# EAGLE schematic M226A (EAGLE 6.6.0)
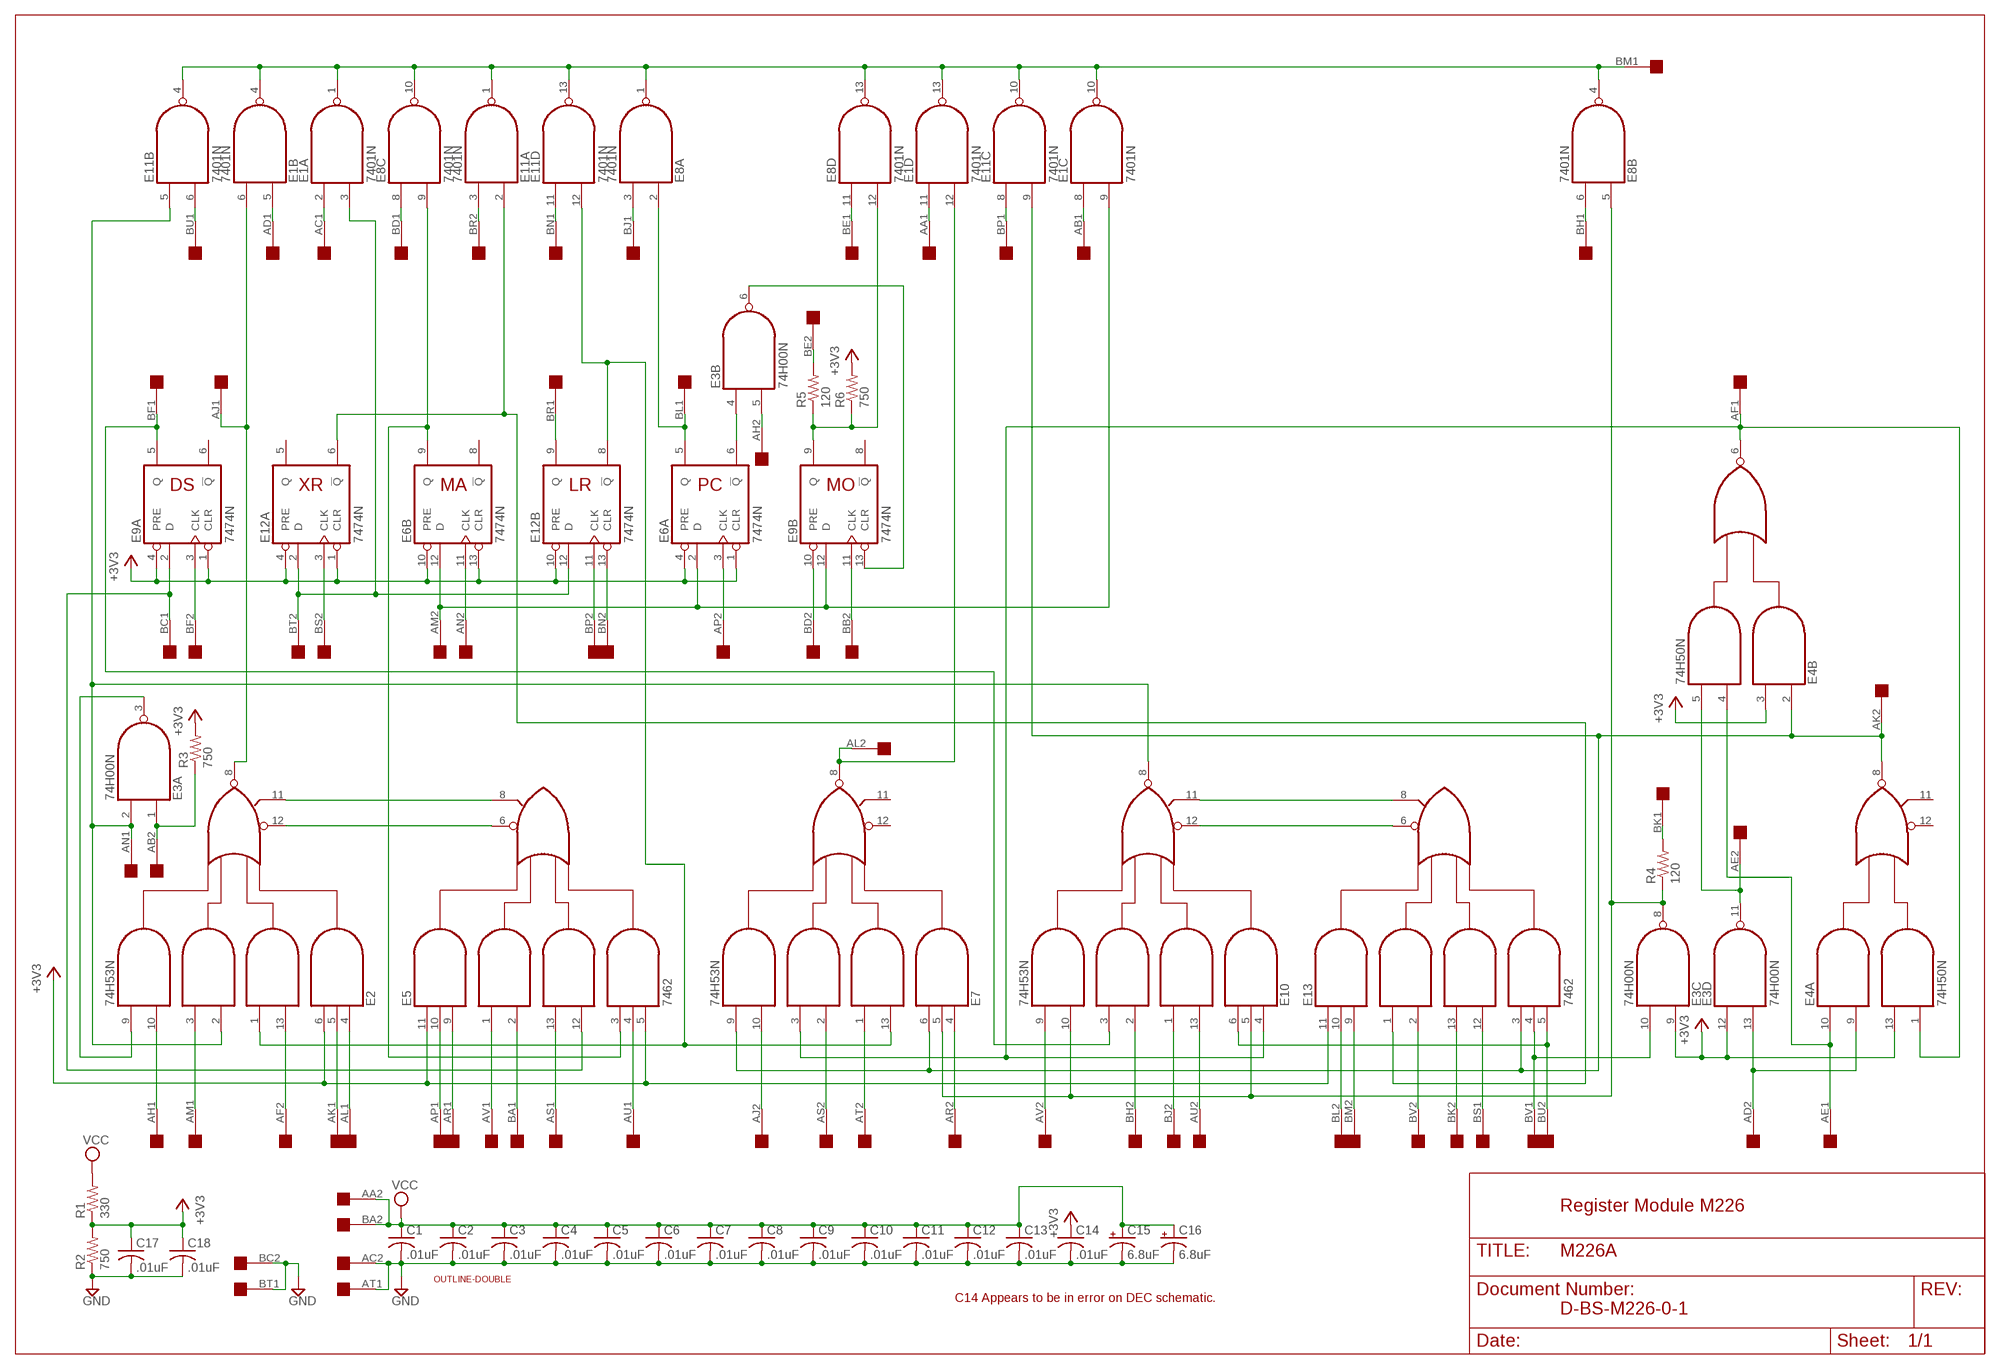
[diagram p0: schematic, sheet 1]

## Parts
C1  .01uF  C-US050-025X075  [C050-025X075]
C2  .01uF  C-US050-025X075  [C050-025X075]
C3  .01uF  C-US050-025X075  [C050-025X075]
C4  .01uF  C-US050-025X075  [C050-025X075]
C5  .01uF  C-US050-025X075  [C050-025X075]
C6  .01uF  C-US050-025X075  [C050-025X075]
C7  .01uF  C-US050-025X075  [C050-025X075]
C8  .01uF  C-US050-025X075  [C050-025X075]
C9  .01uF  C-US050-025X075  [C050-025X075]
C10  .01uF  C-US050-025X075  [C050-025X075]
C11  .01uF  C-US050-025X075  [C050-025X075]
C12  .01uF  C-US050-025X075  [C050-025X075]
C13  .01uF  C-US050-025X075  [C050-025X075]
C14  .01uF  C-US050-025X075  [C050-025X075]
C15  6.8uF  CPOL-USE20-8AXIAL  [E12-8]
C16  6.8uF  CPOL-USE20-8AXIAL  [E12-8]
C17  .01uF  C-US050-025X075  [C050-025X075]
C18  .01uF  C-US050-025X075  [C050-025X075]
E1  7401N  74LS01N  [DIL14]
E2  74H53N  [DIL14]
E3  74H00N  74S00N  [DIL14]
E4  74H50N  7450N  [DIL14]
E5  7462  [DIL14]
E6  7474N  74S74N  [DIL14]
E7  74H53N  [DIL14]
E8  7401N  74LS01N  [DIL14]
E9  7474N  74S74N  [DIL14]
E10  74H53N  [DIL14]
E11  7401N  74LS01N  [DIL14]
E12  7474N  74S74N  [DIL14]
E13  7462  [DIL14]
R1  330  R-US_0207/10  [0207/10]
R2  750  R-US_0207/10  [0207/10]
R3  750  R-US_0207/10  [0207/10]
R4  120  R-US_0207/10  [0207/10]
R5  120  R-US_0207/10  [0207/10]
R6  750  R-US_0207/10  [0207/10]
U$1  OUTLINE-DOUBLE  [DOUBLE]
U$3  DOUBLE  [EDGE-CON4]

## Nets
+3V3 [supply]: C14.1 C17.1 C18.1 E2.6(I2) E3.9(C:I0) E3.12(D:I0) E4.3(B:I2) E4.13(A:I3) E5.5(I10) E5.11(I1) E6.1(A:CLR) E6.4(A:PRE) E6.10(B:PRE) E6.13(B:CLR) E9.1(A:CLR) E9.4(A:PRE) E12.1(A:CLR) E12.4(A:PRE) E12.10(B:PRE) E13.11(I1) R1.1 R2.2 R3.2 R6.2
GND [supply]: C1.2 C2.2 C3.2 C4.2 C5.2 C6.2 C7.2 C8.2 C9.2 C10.2 C11.2 C12.2 C13.2 C14.2 C15.- C16.- C17.2 C18.2 R2.1 U$3.AC2 U$3.AT1 U$3.BC2 U$3.BT1
N$1: E2.12(I9) E5.6(E0)
N$2: E2.11(I10) E5.8(E1)
N$3: E10.11(I10) E13.8(E1)
N$4: E10.12(I9) E13.6(E0)
N$5: E2.10(I7) U$3.AH1
N$6: E2.3(I6) U$3.AM1
N$7: E2.13(I3) U$3.AF2
N$8: E2.4(I1) U$3.AL1
N$9: E2.5(I11) U$3.AK1
N$10: E5.10(I2) U$3.AP1
N$11: E5.9(I3) U$3.AR1
N$12: E5.1(I4) U$3.AV1
N$13: E5.2(I5) U$3.BA1
N$14: E5.13(I6) U$3.AS1
N$15: E5.4(I9) U$3.AU1
N$16: E2.9(I8) E3.3(A:O)
N$17: E4.1(A:I4) E4.6(B:O) E7.3(I6) E10.4(I1) U$3.AF1
N$18: E2.1(I4) E7.13(I3) E11.12(D:I1) E12.8(B:!Q)
N$19: E11.11(D:I0) U$3.BN1
N$20: E5.3(I8) E6.9(B:Q) E8.9(C:I1)
N$21: E5.12(I7) E9.2(A:D) U$3.BC1
N$22: E7.10(I7) U$3.AJ2
N$23: E7.2(I5) U$3.AS2
N$24: E7.1(I4) U$3.AT2
N$25: E7.4(I1) U$3.AR2
N$26: E10.6(I2) E13.5(I10) U$3.BU2
N$27: E1.3(A:I1) E12.2(A:D) E12.12(B:D) U$3.BT2
N$28: E4.2(B:I1) E4.8(A:O) E7.6(I2) E7.9(I8) E11.9(C:I1) E13.3(I8) U$3.AK2
N$29: E3.8(C:O) E7.5(I11) E8.5(B:I0) E10.5(I11) E10.10(I7) R4.1
N$30: E8.11(D:I0) U$3.BE1
N$31: E10.9(I8) U$3.AV2
N$32: E10.2(I5) U$3.BH2
N$33: E10.1(I4) U$3.BJ2
N$34: E10.13(I3) U$3.AU2
N$35: E3.10(C:I1) E13.4(I9) U$3.BV1
N$36: E11.2(A:I0) E12.6(A:!Q) E13.1(I4)
N$37: E13.9(I3) U$3.BM2
N$38: E13.10(I2) U$3.BL2
N$39: E13.2(I5) U$3.BV2
N$40: E13.13(I6) U$3.BK2
N$41: E13.12(I7) U$3.BS1
N$42: E3.13(D:I1) E4.9(A:I2) U$3.AD2
N$43: E4.4(B:I3) E4.10(A:I1) U$3.AE1
N$44: R4.2 U$3.BK1
N$45: E3.11(D:O) E4.5(B:I4) U$3.AE2
N$46: E9.3(A:CLK) U$3.BF2
N$47: E9.5(A:Q) E10.3(I6) U$3.BF1
N$48: E12.3(A:CLK) U$3.BS2
N$49: E1.9(C:I1) E6.2(A:D) E6.12(B:D) E9.12(B:D) U$3.AM2
N$50: E6.11(B:CLK) U$3.AN2
N$52: E1.12(D:I1) E7.8(O) U$3.AL2
N$53: E1.11(D:I0) U$3.AA1
N$54: E12.9(B:Q) U$3.BR1
N$55: E12.13(B:CLR) U$3.BN2
N$56: E12.11(B:CLK) U$3.BP2
N$57: E8.12(D:I1) E9.9(B:Q) R5.1 R6.1
N$58: E6.3(A:CLK) U$3.AP2
N$59: E9.10(B:PRE) U$3.BD2
N$60: E9.11(B:CLK) U$3.BB2
N$61: E3.6(B:O) E9.13(B:CLR)
N$62: E3.5(B:I1) U$3.AH2
N$63: E6.5(A:Q) E8.2(A:I0) U$3.BL1
N$64: E3.4(B:I0) E6.6(A:!Q)
N$65: R5.2 U$3.BE2
N$66: E3.1(A:I0) R3.1 U$3.AB2
N$67: E2.2(I5) E3.2(A:I1) E10.8(O) E11.5(B:I0) U$3.AN1
N$68: E11.6(B:I1) U$3.BU1
N$69: E1.6(B:I1) E2.8(O) U$3.AJ1
N$70: E1.5(B:I0) U$3.AD1
N$71: E1.1(A:O) E1.4(B:O) E1.10(C:O) E1.13(D:O) E8.1(A:O) E8.4(B:O) E8.10(C:O) E8.13(D:O) E11.1(A:O) E11.4(B:O) E11.10(C:O) E11.13(D:O) U$3.BM1
N$72: E1.2(A:I0) U$3.AC1
N$73: E8.8(C:I0) U$3.BD1
N$74: E8.3(A:I1) U$3.BJ1
N$75: E11.8(C:I0) U$3.BP1
N$76: E11.3(A:I1) U$3.BR2
N$77: E8.6(B:I1) U$3.BH1
N$79: E1.8(C:I0) U$3.AB1
VCC [supply]: C1.1 C2.1 C3.1 C4.1 C5.1 C6.1 C7.1 C8.1 C9.1 C10.1 C11.1 C12.1 C13.1 C15.+ C16.+ R1.2 U$3.AA2 U$3.BA2
Unconnected: E4.11(A:I6) E4.12(A:I5) E6.8(B:!Q) E7.11(I10) E7.12(I9) E9.6(A:!Q) E9.8(B:!Q) E12.5(A:Q) U$3.BB1

## Notes on the sheet
- DS | XR | MA | LR | PC | MO
- Register Module M226
- C14 Appears to be in error on DEC schematic.
- D-BS-M226-0-1

## Power pins joined to a net without a drawn wire
GND: E1.7(P:GND) E2.7(GND) E3.7(P:GND) E4.7(P:GND) E5.7(GND) E6.7(P:GND) E7.7(GND) E8.7(P:GND) E9.7(P:GND) E10.7(GND) E11.7(P:GND) E12.7(P:GND) E13.7(GND)
VCC: E1.14(P:VCC) E2.14(VCC) E3.14(P:VCC) E4.14(P:VCC) E5.14(VCC) E6.14(P:VCC) E7.14(VCC) E8.14(P:VCC) E9.14(P:VCC) E10.14(VCC) E11.14(P:VCC) E12.14(P:VCC) E13.14(VCC)

## Library data of the parts
C1-C14 C17 C18 = rcl:C-US: CAPACITOR, American symbol
C15 C16 = dec-con:CPOL-USE20-8AXIAL: A 0.8 inch electrolytic.
E1 E8 E11 = 74xx-us:74*01: Quad 2-input NAND gate, open collector
E2 E7 E10 = dec-con:74H53N: 2-2-2-3 Input And-Or-Invert Gate
E3 = 74xx-us:74*00: Quad 2-input NAND gate
E4 = dec-con:74*50: 4-2-3-2 input AND OR INVERTER gates
E5 E13 = dec-con:74*62: 3-2-2-3 Gate Expander
E6 E9 E12 = 74xx-us:74*74: Dual D type positive edge triggered FLIP FLOP, preset and clear
R1-R6 = rcl:R-US_: RESISTOR, American symbol
U$1 = dec-con:OUTLINE-*: Board outlines for DEC boards.
U$3 = dec-con:DOUBLE: Double-Height DEC board

## Net classes
1 supply: width 0.813 mm